# Altium schematic sheet Core.SchDoc
size A
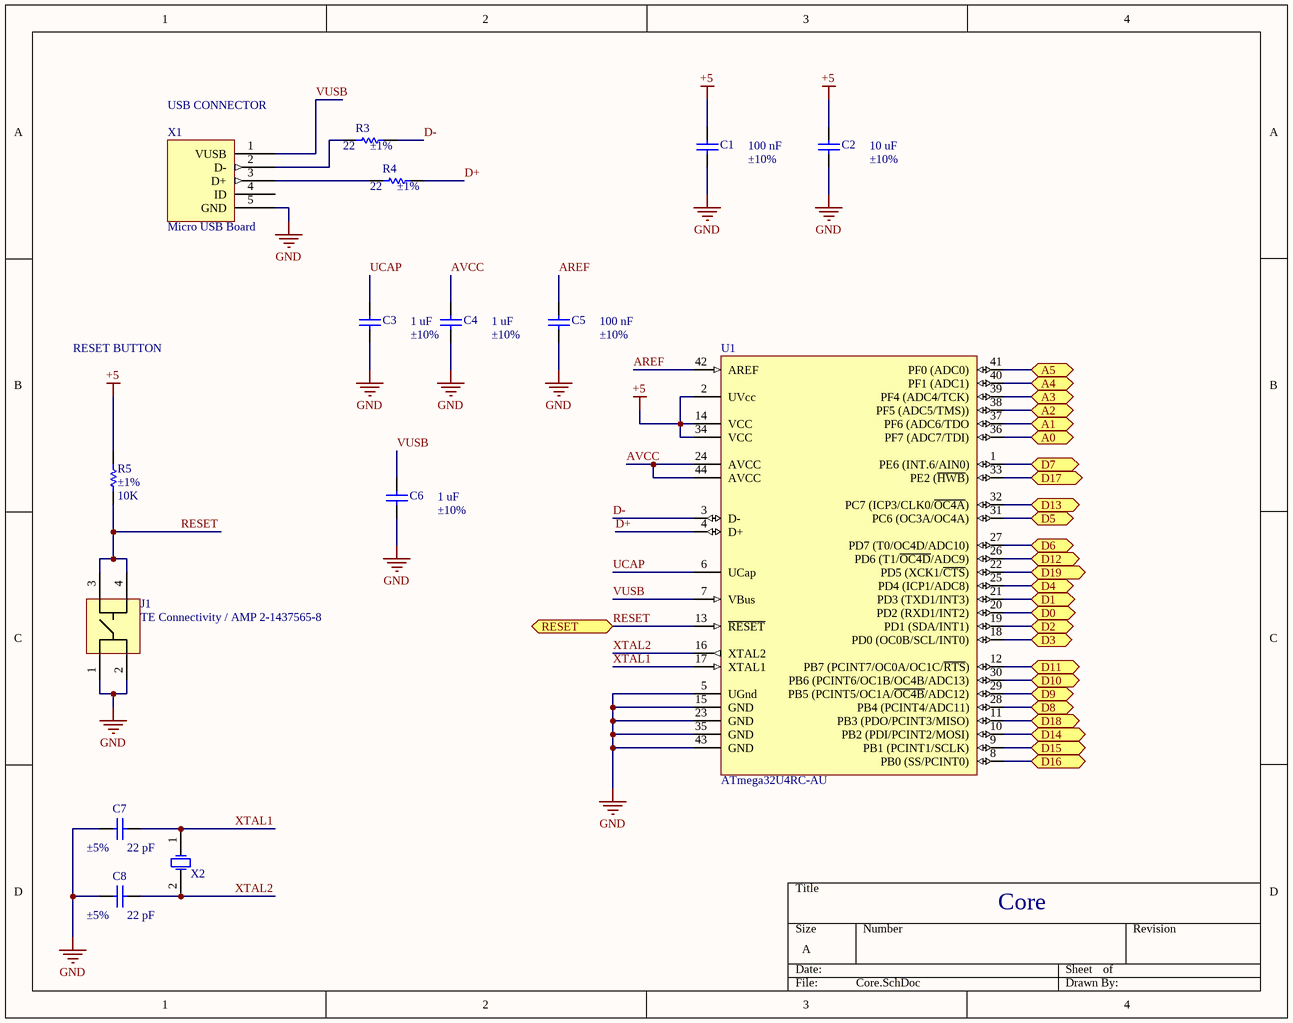
[diagram p0: Core.SchDoc]

## Parts
C1  Capacitance: 100 nF  Capacitance Tolerance: ±10%  [PCB-i747o4qnz4fc2aqkwc14-1]  (hidden comment: Taiyo Yuden LMK212BJ106KG-T)
C2  Capacitance: 10 uF  Capacitance Tolerance: ±10%  [PCB-i747o4qnz4fc2aqkwc14-1]  (hidden comment: Taiyo Yuden LMK212BJ106KG-T)
C3  Capacitance: 1 uF  Capacitance Tolerance: ±10%  [PCB-i747o4qnz4fc2aqkwc14-1]  (hidden comment: Taiyo Yuden LMK212BJ106KG-T)
C4  Capacitance: 1 uF  Capacitance Tolerance: ±10%  [PCB-i747o4qnz4fc2aqkwc14-1]  (hidden comment: Taiyo Yuden LMK212BJ106KG-T)
C5  Capacitance: 100 nF  Capacitance Tolerance: ±10%  [PCB-i747o4qnz4fc2aqkwc14-1]  (hidden comment: Taiyo Yuden LMK212BJ106KG-T)
C6  Capacitance: 1 uF  Capacitance Tolerance: ±10%  [PCB-i747o4qnz4fc2aqkwc14-1]  (hidden comment: Taiyo Yuden LMK212BJ106KG-T)
C7  Capacitance: 22 pF  Capacitance Tolerance: ±5%  [PCB-i747o4qnz4fc2aqkwc14-1]  (hidden comment: Taiyo Yuden LMK212BJ106KG-T)
C8  Capacitance: 22 pF  Capacitance Tolerance: ±5%  [PCB-i747o4qnz4fc2aqkwc14-1]  (hidden comment: Taiyo Yuden LMK212BJ106KG-T)
J1  TE Connectivity / AMP 2-1437565-8  [PCB-70k6oqbhuv68f7gyhifn-1]
R3  Resistance Tolerance: ±1%  Resistance: 22  [PCB-4097432-1]  (hidden comment: Bourns CR0805-FX-4701GLF)
R4  Resistance Tolerance: ±1%  Resistance: 22  [PCB-4097432-1]  (hidden comment: Bourns CR0805-FX-4701GLF)
R5  Resistance Tolerance: ±1%  Resistance: 10K  [PCB-4097432-1]  (hidden comment: Bourns CR0805-FX-4701GLF)
U1  ATmega32U4RC-AU  [44ML_L]
X1  Micro USB Board  [PCB-y0d6oczsv3eu57ue5a53-1]
X2  Fox Electronics FOXSDLF/160-20  [FOX-FOXSDLF-160-20]  (value not drawn)

## Ports
A0 (bidir), A1 (bidir), A2 (bidir), A3 (bidir), A4 (bidir), A5 (bidir), D0 (bidir), D1 (bidir), D2 (bidir), D3 (bidir), D4 (bidir), D5 (bidir), D6 (bidir), D7 (bidir), D8 (bidir), D9 (bidir), D10 (bidir), D11 (bidir), D12 (bidir), D13 (bidir), D14 (bidir), D15 (bidir), D16 (bidir), D17 (bidir), D18 (bidir), D19 (bidir), RESET

## Nets
+5: C1.2 C2.2 R5.2 U1.2(UVcc) U1.14(VCC) U1.34(VCC)
GND: C1.1 C2.1 C3.1 C4.1 C5.1 C6.1 C7.1 C8.1 J1.1 J1.2 U1.5(UGnd) U1.15(GND) U1.23(GND) U1.35(GND) U1.43(GND) X1.5(GND)
A0: U1.36(PF7_(ADC7/TDI)) ; port A0
A1: U1.37(PF6_(ADC6/TDO) ; port A1
A2: U1.38(PF5_(ADC5/TMS))) ; port A2
A3: U1.39(PF4_(ADC4/TCK)) ; port A3
A4: U1.40(PF1_(ADC1)) ; port A4
A5: U1.41(PF0_(ADC0)) ; port A5
AREF: C5.2 U1.42(AREF)
AVCC: C4.2 U1.24(AVCC) U1.44(AVCC)
D0: U1.20(PD2_(RXD1/INT2)) ; port D0
D1: U1.21(PD3_(TXD1/INT3)) ; port D1
D2: U1.19(PD1_(SDA/INT1)) ; port D2
D3: U1.18(PD0_(OC0B/SCL/INT0)) ; port D3
D4: U1.25(PD4_(ICP1/ADC8)) ; port D4
D5: U1.31(PC6_(OC3A/OC4A)) ; port D5
D6: U1.27(PD7_(T0/OC4D/ADC10)) ; port D6
D7: U1.1(PE6_(INT.6/AIN0)) ; port D7
D8: U1.28(PB4_(PCINT4/ADC11)) ; port D8
D9: U1.29(PB5_(PCINT5/OC1A/~{OC4B}/ADC12)) ; port D9
D10: U1.30(PB6_(PCINT6/OC1B/OC4B/ADC13)) ; port D10
D11: U1.12(PB7_(PCINT7/OC0A/OC1C/~{RTS})) ; port D11
D12: U1.26(PD6_(T1/~{OC4D}/ADC9)) ; port D12
D13: U1.32(PC7_(ICP3/CLK0/~{OC4A})) ; port D13
D14: U1.10(PB2_(PDI/PCINT2/MOSI)) ; port D14
D15: U1.9(PB1_(PCINT1/SCLK)) ; port D15
D16: U1.8(PB0_(SS/PCINT0)) ; port D16
D17: U1.33(PE2_(~{HWB})) ; port D17
D18: U1.11(PB3_(PDO/PCINT3/MISO)) ; port D18
D19: U1.22(PD5_(XCK1/~{CTS})) ; port D19
D+: R4.2 U1.4(D+)
D-: R3.2 U1.3(D-)
RESET: J1.3 J1.4 R5.1 U1.13(~{RESET}) ; port RESET
UCAP: C3.2 U1.6(UCap)
VUSB: C6.2 U1.7(VBus) X1.1(VUSB)
XTAL1: C7.2 U1.17(XTAL1) X2.1(OSC1)
XTAL2: C8.2 U1.16(XTAL2) X2.2(OSC2)
NetR3_1: R3.1 X1.2(D-)
NetR4_1: R4.1 X1.3(D+)

Not connected (* = marked no-connect by the designer): X1 4(ID)

## Notes on the sheet
- (near X1) USB CONNECTOR
- RESET BUTTON
- Core

## Library data of the parts
C1-C8 = CMP-6ecba7c24c09b10c-2: Cap Ceramic 10uF 10V X5R 10% SMD 0805 85?C T/R; Lead-Free Status: Lead Free; Voltage Rating (DC): 10.0 V; Case/Package (SI): 2012; Mounting Style: Surface Mount; Manufacturer Part Number: LMK212BJ106KG-T; Packaging: Cut Tape (CT); RoHS: Compliant; Number of Pins: 2; Lifecycle Status: Not Listed by Manufacturer; OctopartID: 6ecba7c24c09b10c; Size-Length: 0.002 m; Size-Height: 0.00125 m; Dielectric Characteristic: X5R; Octopart URL: http://octopart.com/lmk212bj106kg-t-taiyo+yuden-198564; Size-Width: 0.00125 m; Case/Package: 0805
J1 = 2-1437565-8: Switch Tactile OFF (ON) SPST Round Button Gull Wing 0.05A 12VDC 2.55N SMD Loose Piece; ELV Compliant: Compliant; Lead-Free Status: Lead Free; Contact Material: Copper Alloy; Contacts Type: SPST; Mounting Style: Surface Mount; OctopartID: fb7e300dae6a24b9; Lifecycle Status: Active; Manufacturer Part Number: 2-1437565-8; Contact Plating: Silver; RoHS: Compliant; Octopart URL: http://octopart.com/2-1437565-8-te+connectivity+%2F+amp-41513074
R3-R5 = CMP-97505e06006c4897-1: Res Thick Film 0805 4.7K Ohm 1% 1/8W ±100ppm/°C Molded SMD SMD Paper Tape on Plastic Reel; Voltage Rating (DC): 150 V; Power Rating: 125 mW; Manufacturer Part Number: CR0805-FX-4701GLF; REACH SVHC Compliance: No SVHC; OctopartID: 97505e06006c4897; Packaging: Tape & Reel (TR), Cut Tape (CT); Octopart URL: http://octopart.com/cr0805-fx-4701glf-bourns-6074970; Number of Pins: 2; Mounting Style: Surface Mount; RoHS: Compliant; Size-Thickness: 508 µm; Size-Length: 2.01 mm; Case/Package: 0805; Size-Width: 1.24 mm
U1 = ATMEGA32U4RC-AU: 8-bit AVR Microcontroller, 2.7-5.5V, 16MHz, 32KB Flash, 1KB EEPROM, 2.5KB SRAM, USB Controller, 44-pin TQFP, Industrial Grade (-40°C to 85°C), Int RC; Manufacturer: Atmel; Processor Series: ATMEGA32x; CiivaID: 973239; On-Chip ADC: Yes; Data Bus Width: 8 bit; Operating Supply Voltage: 2.7 V to 5.5 V; Core: AVR; Data RAM Size: 2.5 KB; Mounting Style: SMD/SMT; Maximum Clock Frequency: 16 MHz; Operating Temperature Range: - 40 C to + 85 C; Program Memory Size: 32 KB; RoHS: Details; Package / Case: QFP-44; Factory Pack Quantity: 800; Ciiva URL: https://ciiva.com/part/atmega32u4rc-au-973239
X1 = CMP-dryhiu0utvtqwfw1f267-2: CustomComponentID: dryhiu0utvtqwfw1f267
X2 = CMP-779572-4: CRYSTAL 16.0MHZ 20PF SMD; Frequency: 16000000.0 Hz; Lead-Free Status: Lead Free; Load Capacitance: 2e-11 F; Size-Height: 0.0045 m; REACH SVHC Compliance: No SVHC; Size-Length: 0.0129 m; RoHS: Compliant; Mounting Style: Surface Mount; Case/Package: HC-49; Packaging: Cut Tape (CT); Octopart Url: https://octopart.com/foxsdlf%2F160-20-fox+electronics-126664; OctopartID: 4a7c837781d295bb; Number of Pins: 2; Size-Width: 0.005 m